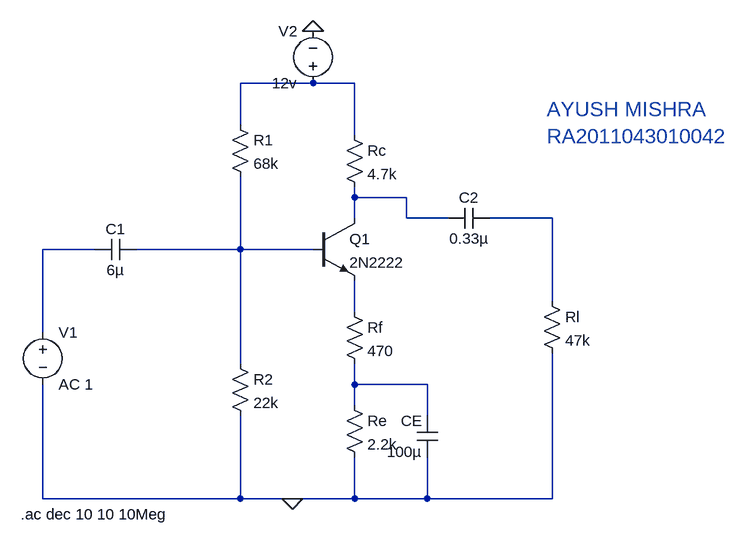
[diagram p0: schematic exp 7.asc]
exp 7.asc, the LTspice schematic file:
Version 4
SHEET 1 880 680
WIRE 176 -96 64 -96
WIRE 240 -96 176 -96
WIRE 64 -32 64 -96
WIRE 240 -16 240 -96
WIRE 240 80 240 64
WIRE 320 80 240 80
WIRE 240 112 240 80
WIRE 320 112 320 80
WIRE 384 112 320 112
WIRE 544 112 448 112
WIRE -160 160 -240 160
WIRE 64 160 64 48
WIRE 64 160 -96 160
WIRE 176 160 64 160
WIRE 544 240 544 112
WIRE 240 256 240 208
WIRE -240 288 -240 160
WIRE 64 336 64 160
WIRE 240 368 240 336
WIRE 352 368 240 368
WIRE 240 400 240 368
WIRE 352 416 352 368
WIRE -240 544 -240 368
WIRE 64 544 64 416
WIRE 64 544 -240 544
WIRE 144 544 64 544
WIRE 240 544 240 480
WIRE 240 544 144 544
WIRE 352 544 352 480
WIRE 352 544 240 544
WIRE 544 544 544 320
WIRE 544 544 352 544
FLAG 176 -176 0
FLAG 144 544 0
SYMBOL npn 176 112 R0
SYMATTR InstName Q1
SYMATTR Value 2N2222
SYMBOL res 48 -48 R0
SYMATTR InstName R1
SYMATTR Value 68k
SYMBOL res 48 320 R0
SYMATTR InstName R2
SYMATTR Value 22k
SYMBOL res 224 -32 R0
SYMATTR InstName Rc
SYMATTR Value 4.7k
SYMBOL res 224 240 R0
SYMATTR InstName Rf
SYMATTR Value 470
SYMBOL res 224 384 R0
SYMATTR InstName Re
SYMATTR Value 2.2k
SYMBOL res 528 224 R0
SYMATTR InstName Rl
SYMATTR Value 47k
SYMBOL cap -96 144 R90
WINDOW 0 0 32 VBottom 2
WINDOW 3 32 32 VTop 2
SYMATTR InstName C1
SYMATTR Value 6µ
SYMBOL cap 448 96 R90
WINDOW 0 0 32 VBottom 2
WINDOW 3 32 32 VTop 2
SYMATTR InstName C2
SYMATTR Value 0.33µ
SYMBOL cap 368 480 R180
WINDOW 0 24 56 Left 2
WINDOW 3 24 8 Left 2
SYMATTR InstName CE
SYMATTR Value 100µ
SYMBOL voltage -240 272 R0
WINDOW 123 0 0 Left 0
WINDOW 39 0 0 Left 0
SYMATTR InstName V1
SYMATTR Value AC 1
SYMBOL voltage 176 -80 R180
WINDOW 0 24 96 Left 2
WINDOW 3 24 16 Left 2
WINDOW 123 0 0 Left 0
WINDOW 39 0 0 Left 0
SYMATTR InstName V2
SYMATTR Value 12v
TEXT -274 568 Left 2 !.ac dec 10 10 10Meg
TEXT 536 -56 Left 3 ;AYUSH MISHRA\nRA2011043010042

The netlist it stands for:
* exp 7.asc
Q1 N002 N005 N006 0 2N2222
R1 N001 N005 68k
R2 N005 0 22k
Rc N001 N002 4.7k
Rf N006 N007 470
Re N007 0 2.2k
Rl N003 0 47k
C1 N005 N004 6µ
C2 N003 N002 0.33µ
CE 0 N007 100µ
V1 N004 0 AC 1
V2 N001 0 12v
.model NPN NPN
.model PNP PNP
.lib standard.bjt
.ac dec 10 10 10Meg
* AYUSH MISHRA
* RA2011043010042
.backanno
.end